# Altium schematic sheet RECEPTORA_SECUNDARIA.SchDoc
size A3
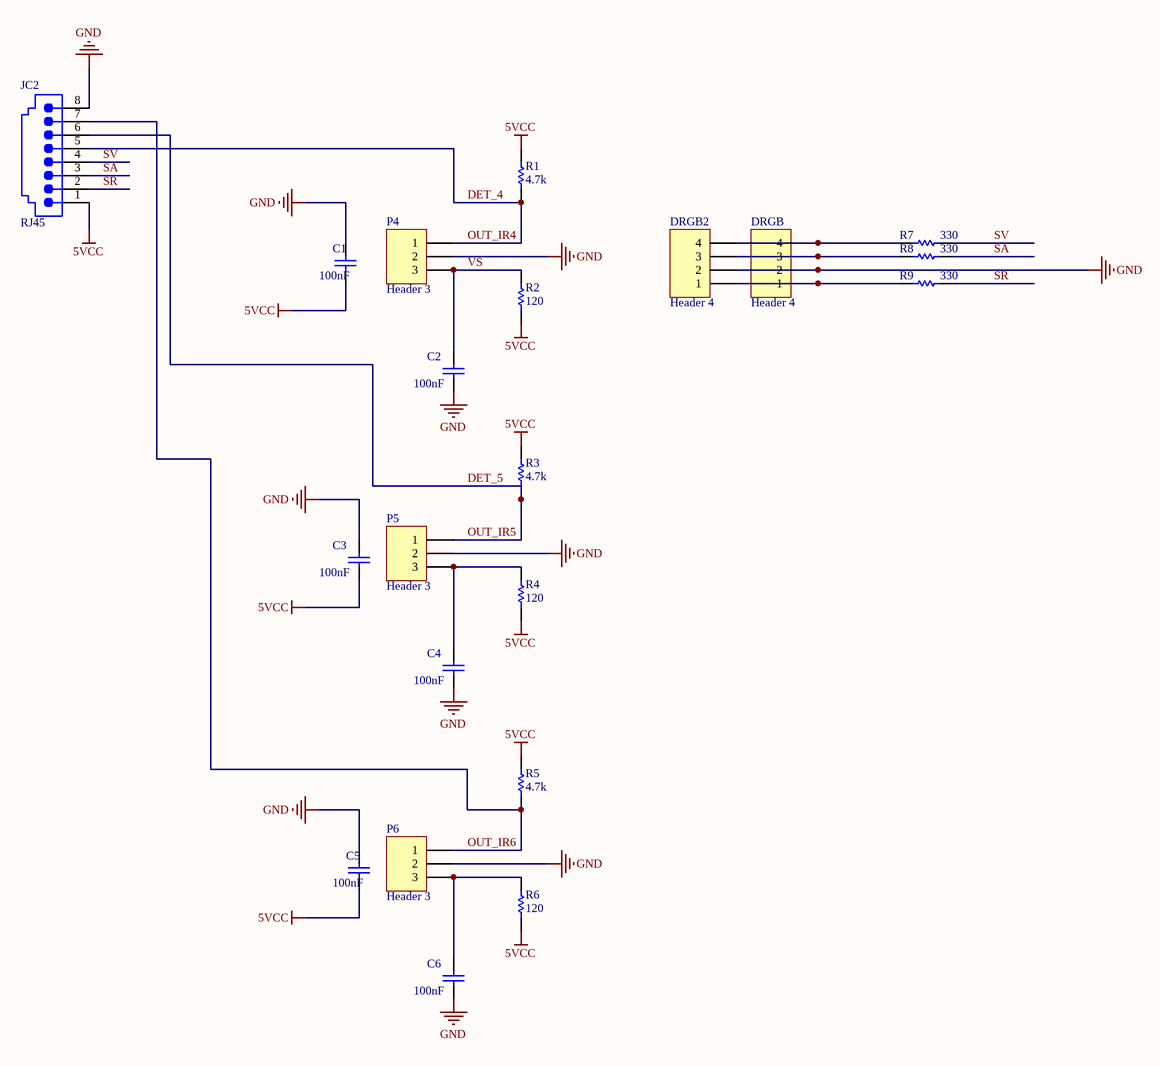
[diagram p0: RECEPTORA_SECUNDARIA.SchDoc]

## Parts
C1  value 100nF  [VP44-2.5]  (hidden comment: VP44BY224JB)
C2  value 100nF  [VP44-2.5]  (hidden comment: VP44BY224JB)
C3  value 100nF  [VP44-2.5]  (hidden comment: VP44BY224JB)
C4  value 100nF  [VP44-2.5]  (hidden comment: VP44BY224JB)
C5  value 100nF  [VP44-2.5]  (hidden comment: VP44BY224JB)
C6  value 100nF  [VP44-2.5]  (hidden comment: VP44BY224JB)
DRGB  Header 4  [HDR1X4]
DRGB2  Header 4  [FP_LRGB_TH]
JC2  RJ45  [15-43-6233]
P4  Header 3  [HDR1X3]
P5  Header 3  [HDR1X3]
P6  Header 3  [HDR1X3]
R1  value 4.7k  [AXIAL-0.3]  (hidden comment: Res)
R2  value 120  [AXIAL-0.3]  (hidden comment: Res)
R3  value 4.7k  [AXIAL-0.3]  (hidden comment: Res)
R4  value 120  [AXIAL-0.3]  (hidden comment: Res)
R5  value 4.7k  [AXIAL-0.3]  (hidden comment: Res)
R6  value 120  [AXIAL-0.3]  (hidden comment: Res)
R7  value 330  [AXIAL-0.3]  (hidden comment: Res)
R8  value 330  [AXIAL-0.3]  (hidden comment: Res)
R9  value 330  [AXIAL-0.3]  (hidden comment: Res)

## Nets
5VCC: C1.2 C3.2 C5.2 JC2.1 R1.2 R2.1 R3.2 R4.1 R5.2 R6.1
GND: C1.1 C2.2 C3.1 C4.2 C5.1 C6.2 DRGB.2 DRGB2.2 JC2.8 P4.2 P5.2 P6.2
DET_4: JC2.5 P4.1 R1.1  [also labelled OUT_IR4]
DET_5: JC2.6 P5.1 R3.1  [also labelled OUT_IR5]
OUT_IR6: JC2.7 P6.1 R5.1
SA: JC2.3 R8.2
SR: JC2.2 R9.2
SV: JC2.4 R7.2
VS: C2.1 P4.3 R2.2
NetC4_1: C4.1 P5.3 R4.2
NetC6_1: C6.1 P6.3 R6.2
NetDRGB_1: DRGB.1 DRGB2.1 R9.1
NetDRGB_3: DRGB.3 DRGB2.3 R8.1
NetDRGB_4: DRGB.4 DRGB2.4 R7.1

## Library data of the parts
C1-C6 = VP44BY224JB: Dipped Radial Multilayer Ceramic Capacitor X7R: 220nF, 100V; Published: 17-Dec-2003; DatasheetDocument: 4-Feb-2002; PackageDocument: 4-Feb-2002; PackageReference: VP44-2.5; Publisher: Altium Limited; ComponentLink1Description: Manufacturer Link; ComponentLink1URL: http://www.vishay.com/
DRGB DRGB2 = Header 4: Header, 4-Pin; LatestRevisionDate: 17-Jul-2002; LatestRevisionNote: Re-released for DXP Platform.; Publisher: Altium Limited
JC2 = 15-43-6233: Right Angle, Standard Profile, RJ45-Keyed, Flange Mount PCB Jack; Ports: 1; Positions/Loaded: Port1 - 8 Keyed/8; PerformanceCategory: 3; PCB_Mounting: Thru-Hole; ComponentAvailability: Obsolete; DrillSize: Nominal, Rounded to nearest 0.05mm; PCB_Layout: Complies with Manufacturer's Recommendation.; Published: 25-Jun-2002; DatasheetDocument: 18-Dec-2001; PackageDocument: 18-Dec-2001; PackageReference: 15-43-6233; Publisher: Altium Limited; ComponentLink1Description: Manufacturer Link; ComponentLink1URL: http://www.molex.com/; ComponentLink2Description: Datasheet; ComponentLink2URL: http://www.molex.com/cmc_upload/common_files/1212003_catalogmx41314.pdf; ComponentLink3Description: Iges Model; ComponentLink3URL: http://www.molex.com/pdm_docs/igs/15-43-6233_igs.zip
P4-P6 = Header 3: Header, 3-Pin; LatestRevisionDate: 17-Jul-2002; LatestRevisionNote: Re-released for DXP Platform.; Publisher: Altium Limited
R1-R9 = Res1: Resistor; Published: 8-Jun-2000; LatestRevisionDate: 17-Jul-2002; LatestRevisionNote: Re-released for DXP Platform.; PackageReference: AXIAL-0.3; Publisher: Altium Limited